# Altium schematic sheet 3VSupply.SchDoc
size A
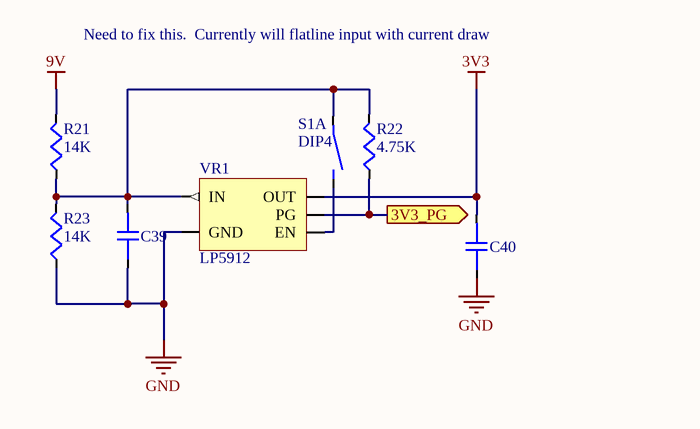
[diagram p0: 3VSupply.SchDoc]

## Parts
C39  1uF  (value not drawn)
C40  1uF  (value not drawn)
R21  14K
R22  4.75K
R23  14K
S1  DIP4  (part A of 4)
VR1  LP5912

## Ports
3V3_PG (out)

## Nets
3V3: C40.1 VR1.1(OUT)
9V: R21.2
GND: C39.2 C40.2 R23.1 VR1.5(GND)
3V3_PG: R22.1 VR1.3(PG) ; port 3V3_PG
NetC39_1: C39.1 R21.1 R22.2 R23.2 S1.1 VR1.6(IN)
NetS1_2: S1.2 VR1.4(EN)

## Notes on the sheet
- Need to fix this.  Currently will flatline input with current draw

## Library data of the parts
C39 C40 = CL10B105KO8NNNC: Cap Ceramic 1uF 16V X7R 10% SMD 0603 125C T/R; Manufacturer 1: Samsung; Supplier 1: Digi-Key; Supplier Part Number 1: 1276-1019-1-ND; Manufacturer Part Number 1: CL10B105KO8NNNC; Stock 1: 4048324; Pricing 1: 1=0.10000, 10=0.04800, 100=0.02120, 500=0.01516, 1000=0.01192 (USD); RoHS: Yes; Mount: Surface Mount; Case/Package: 0603; Case Code (Metric): 1608; Case Code (Imperial): 0603; Material: Ceramic; Min Operating Temperature: -55°C; Max Operating Temperature: 125°C; Packaging: Tape and Reel; Tolerance: 10%; Capacitance: 1uF; Voltage Rating: 16V; Dielectric: X7R; Voltage: 16V; Voltage Rating (DC): 16V; Length: 1.6mm; Height: 0.8mm; Width: 0.031inch; Thickness: 0.035inch; Depth: 0.8mm; Radiation Hardening: No; Lead Free: Lead Free; ComponentLink1URL: https://datasheet.ciiva.com/15195/getdatasheetpartid-357418-15195728.pdf?src-supplier=Verical; ComponentLink1Description: https://datasheet.ciiva.com/15195/getdatasheetpartid-357418-15195728.pdf?src-supplier=Verical; ComponentLink2URL: https://datasheet.ciiva.com/29198/458176-da-01-en-vs-kondensator-0603-29198478.pdf?src-supplier=Conrad; ComponentLink2Description: https://datasheet.ciiva.com/29198/458176-da-01-en-vs-kondensator-0603-29198478.pdf?src-supplier=Conrad
R21 R23 = TNPW060314K0BEEA: Res Thin Film 0603 14K Ohm 0.1% 1/10W ±25ppm/°C Molded SMD SMD Paper T/R; Manufacturer 1: Vishay Dale; Resistance: 14kR; Power Rating: 100mW; Voltage Rating: 75V; Voltage Rating (DC): 50V; Supplier 1: Digi-Key; Supplier Part Number 1: TNP14.0KAACT-ND; Manufacturer Part Number 1: TNPW060314K0BEEA; Stock 1: 9106; Pricing 1: 1=0.65000, 10=0.46200, 100=0.24020, 1000=0.12936, 2500=0.12760 (USD); RoHS: Yes; Mount: Surface Mount; Case/Package: 0603; Weight: 7.1E-05oz; Case Code (Metric): 1608; Case Code (Imperial): 0603; Contact Plating: Tin; Min Operating Temperature: -55°C; Max Operating Temperature: 125°C; Package Quantity: 1; Tolerance: 0.1%; Packaging: Tape and Reel; Composition: Thin Film; Number of Terminations: 2; Termination: SMD/SMT; Military Standard: Not; Max Power Dissipation: 100mW; Temperature Coefficient: 25ppm/°C; Features: Moisture Resistant,Automotive AEC-Q200,Anti-Sulfur; Length: 1.6mm; Height: 0.45mm; Width: 0.033inch; Depth: 0.85mm; Radiation Hardening: No; REACH SVHC: Unknown; Lead Free: Lead Free; ComponentLink1URL: https://datasheet.ciiva.com/2483/tnpw-e3-2483298.pdf?src-supplier=Digi-Key; ComponentLink1Description: https://datasheet.ciiva.com/2483/tnpw-e3-2483298.pdf?src-supplier=Digi-Key; ComponentLink2URL: https://datasheet.ciiva.com/2483/tnpw-e3-2483299.pdf?src-supplier=Digi-Key; ComponentLink2Description: https://datasheet.ciiva.com/2483/tnpw-e3-2483299.pdf?src-supplier=Digi-Key; ComponentLink3URL: https://datasheet.ciiva.com/2483/tnpw-e3-2483300.pdf?src-supplier=Digi-Key; ComponentLink3Description: https://datasheet.ciiva.com/2483/tnpw-e3-2483300.pdf?src-supplier=Digi-Key; ComponentLink4URL: https://datasheet.ciiva.com/16391/tnpw-e3-16391669.pdf?src-supplier=Future+Electronics; ComponentLink4Description: https://datasheet.ciiva.com/16391/tnpw-e3-16391669.pdf?src-supplier=Future+Electronics; ComponentLink5URL: https://datasheet.ciiva.com/7743/tnpw-e3-7743801.pdf?src-supplier=Element14; ComponentLink5Description: https://datasheet.ciiva.com/7743/tnpw-e3-7743801.pdf?src-supplier=Element14; ComponentLink6URL: https://datasheet.ciiva.com/9041/tnpw-e3-9041772.pdf?src-supplier=Avnet; ComponentLink6Description: https://datasheet.ciiva.com/9041/tnpw-e3-9041772.pdf?src-supplier=Avnet
R22 = TNPW06034K75BEEA: Res Thin Film 0603 4.75K Ohm 0.1% 1/10W ±25ppm/°C Molded SMD SMD Paper T/R; Manufacturer 1: Vishay Dale; Resistance: 4.75kR; Power Rating: 100mW; Voltage Rating: 75V; Voltage Rating (DC): 50V; Supplier 1: Digi-Key; Supplier Part Number 1: TNP4.75KAACT-ND; Manufacturer Part Number 1: TNPW06034K75BEEA; Stock 1: 10015; Pricing 1: 1=0.65000, 10=0.46200, 100=0.24020, 1000=0.12936, 2500=0.12760 (USD); RoHS: Yes; Case/Package: 0603; Weight: 7.1E-05oz; Case Code (Metric): 1608; Case Code (Imperial): 0603; Contact Plating: Tin; Min Operating Temperature: -55°C; Max Operating Temperature: 125°C; Tolerance: 0.1%; Packaging: Tape and Reel; Package Quantity: 1; Composition: Thin Film; Number of Terminations: 2; Termination: SMD/SMT; Military Standard: Not; Temperature Coefficient: 25ppm/°C; Max Power Dissipation: 100mW; Features: Moisture Resistant,Automotive AEC-Q200,Anti-Sulfur; Length: 1.6mm; Height: 0.45mm; Width: 0.033inch; Depth: 0.85mm; Radiation Hardening: No; REACH SVHC: Unknown; Lead Free: Lead Free; ComponentLink1URL: https://datasheet.ciiva.com/9070/tnpw-e3-9070279.pdf?src-supplier=Avnet; ComponentLink1Description: https://datasheet.ciiva.com/9070/tnpw-e3-9070279.pdf?src-supplier=Avnet; ComponentLink2URL: https://datasheet.ciiva.com/2483/tnpw-e3-2483244.pdf?src-supplier=Digi-Key; ComponentLink2Description: https://datasheet.ciiva.com/2483/tnpw-e3-2483244.pdf?src-supplier=Digi-Key; ComponentLink3URL: https://datasheet.ciiva.com/7743/tnpw-e3-7743820.pdf?src-supplier=Element14; ComponentLink3Description: https://datasheet.ciiva.com/7743/tnpw-e3-7743820.pdf?src-supplier=Element14; ComponentLink4URL: https://datasheet.ciiva.com/2483/tnpw-e3-2483245.pdf?src-supplier=Digi-Key; ComponentLink4Description: https://datasheet.ciiva.com/2483/tnpw-e3-2483245.pdf?src-supplier=Digi-Key; ComponentLink5URL: https://datasheet.ciiva.com/2483/tnpw-e3-2483246.pdf?src-supplier=Digi-Key; ComponentLink5Description: https://datasheet.ciiva.com/2483/tnpw-e3-2483246.pdf?src-supplier=Digi-Key
S1 = SDA04H0SBR: SWITCH DIP TAPE SEALED 4POS 24V; Manufacturer 1: ITT C&K; Body Material: Polyphenylene; Mechanical Life: 1000Cycles; Actuator Material: Polyamide; Throw Configuration: SPST; Number of Positions: 4; Current Rating: 25mA; Max Current Rating: 100mA; Contact Resistance: 50mR; Actuator Type: Slide (Standard); Pitch: 0.1inch; Actuator Length: 0mm; Washable: Yes; Supplier 1: Digi-Key; Supplier Part Number 1: CKN9493CT-ND; Manufacturer Part Number 1: SDA04H0SBR; Stock 1: 868; Pricing 1: 1=2.05000, 10=1.93600, 25=1.85680, 50=1.73820, 100=1.69880, 250=1.50124 (USD); RoHS: Yes; Mount: Surface Mount; Contact Material: Copper; Contact Plating: Gold; Min Operating Temperature: -40°C; Max Operating Temperature: 85°C; Max Voltage Rating (DC): 24V; Termination: Gull Wing; Package Quantity: 1; Packaging: Tape and Reel; Voltage Rating (DC): 24V; Electrical Life: 1000Cycles; Number of Circuits: 4; Orientation: Straight; Length: 0.476inch; Terminal Pitch: 2.54mm; Depth: 9.3mm; Radiation Hardening: No; REACH SVHC: No SVHC; Lead Free: Lead Free; ComponentLink1URL: https://datasheet.ciiva.com/2863/sda-17mar15-2863556.pdf?src-supplier=Digi-Key; ComponentLink1Description: https://datasheet.ciiva.com/2863/sda-17mar15-2863556.pdf?src-supplier=Digi-Key; ComponentLink2URL: https://datasheet.ciiva.com/2863/sda-17mar15-2863557.pdf?src-supplier=Digi-Key; ComponentLink2Description: https://datasheet.ciiva.com/2863/sda-17mar15-2863557.pdf?src-supplier=Digi-Key; ComponentLink3URL: https://datasheet.ciiva.com/2863/sda-17mar15-2863558.pdf?src-supplier=Digi-Key; ComponentLink3Description: https://datasheet.ciiva.com/2863/sda-17mar15-2863558.pdf?src-supplier=Digi-Key; ComponentLink4URL: https://datasheet.ciiva.com/22630/1707734-22630650.pdf?src-supplier=Element14; ComponentLink4Description: https://datasheet.ciiva.com/22630/1707734-22630650.pdf?src-supplier=Element14; ComponentLink5URL: https://datasheet.ciiva.com/16200/sda-13may-16200990.pdf?src-supplier=Onlinecomponents.com; ComponentLink5Description: https://datasheet.ciiva.com/16200/sda-13may-16200990.pdf?src-supplier=Onlinecomponents.com
VR1 = LP5912-3.3DRVT: IC REG LINEAR 3.3V 500MA 6SON; Manufacturer 1: Texas Instruments; Dropout Voltage: 950mV; Quiescent Current: 30uA; Number of Regulators: 1; Supplier 1: Digi-Key; Supplier Part Number 1: 296-44153-1-ND; Manufacturer Part Number 1: LP5912-3.3DRVT; Stock 1: 2229; Pricing 1: 1=1.38000, 10=1.23100, 100=0.95940 (USD); RoHS: Yes; Mount: Surface Mount; Number of Pins: 6; Min Operating Temperature: -40°C; Max Operating Temperature: 125°C; Output Current: 500mA; Packaging: Tape and Reel; Output Voltage: 3.3V; Lead Free: Lead Free; ComponentLink1URL: http://www.ti.com/lit/ds/symlink/lp5912.pdf?src-supplier=Digi-Key; ComponentLink1Description: http://www.ti.com/lit/ds/symlink/lp5912.pdf?src-supplier=Digi-Key; ComponentLink2URL: http://www.ti.com/lit/ds/symlink/lp5912.pdf?src-supplier=Farnell; ComponentLink2Description: http://www.ti.com/lit/ds/symlink/lp5912.pdf?src-supplier=Farnell; ComponentLink3URL: http://www.ti.com/general/docs/lit/getliterature.tsp?genericPartNumber=LP5912&amp;&amp;fileType=pdf&src-supplier=Element14; ComponentLink3Description: http://www.ti.com/general/docs/lit/getliterature.tsp?genericPartNumber=LP5912&amp;&amp;fileType=pdf&src-supplier=Element14